# Altium schematic sheet CAN-Transceiver.SchDoc: CAN Transceiver 3V3
size A3; DrawnBy: Jonn Dillon; DocumentNumber: N/A; Revision: 02; SheetNumber: 1; SheetTotal: 1; Version: 01; Project: QUTMS Common Altium Schematics; PageSetup: Record=PageOptions|CenterHorizontal=True|CenterVertical=True|PrintScale=0.97|XCorrection=1.00|YCorrection=1.00|PrintKind=0|BorderSize=5000000|LeftOffset=0|BottomOffset=0|Orientation=2|PaperLength=1000|PaperWidth=1000|Scale=100|PaperSource=7|PrintQuality=-4|MediaType=1|DitherType=10|PaperKind=A4|PrintScaleMode=1
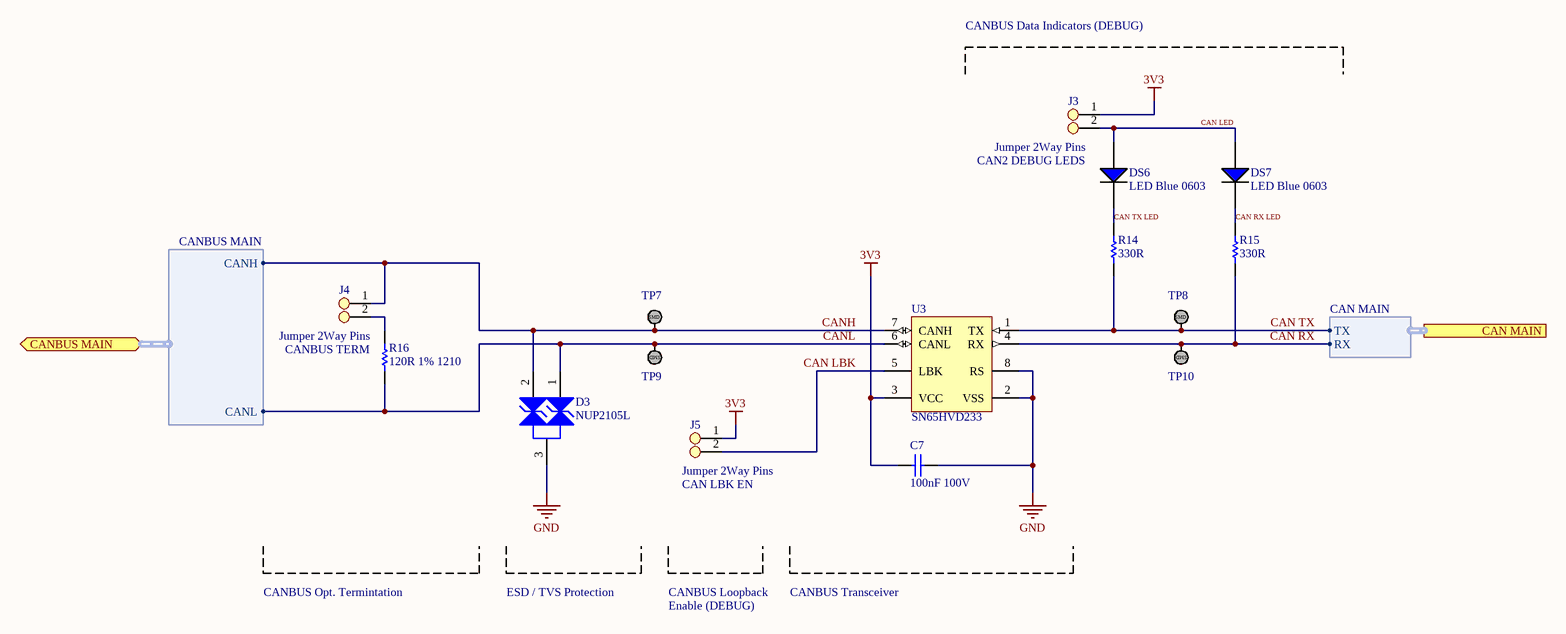
[diagram p0: CAN-Transceiver.SchDoc]

## Parts
C7  100nF 100V  [Cap_Ceramic_0603]
D3  NUP2105L  [NUP2105L]
DS6  LED Blue 0603  [LED BLUE 0603]
DS7  LED Blue 0603  [LED BLUE 0603]
J3  Jumper 2Way Pins  [Jumper_2Way_Pin]
J4  Jumper 2Way Pins  [Jumper_2Way_Pin]
J5  Jumper 2Way Pins  [Jumper_2Way_Pin]
R14  330R  [Res_ThinFilm_0603]
R15  330R  [Res_ThinFilm_0603]
R16  120R 1% 1210  [Res_ThinFilm_1210]
TP7  TestPoint_SMD  [TestPointSMD]  (value not drawn)
TP8  TestPoint_SMD  [TestPointSMD]  (value not drawn)
TP9  TestPoint_SMD  [TestPointSMD]  (value not drawn)
TP10  TestPoint_SMD  [TestPointSMD]  (value not drawn)
U3  SN65HVD233  [SN65HVD233DR]

## Ports
CAN MAIN (harness CAN MAIN), CANBUS MAIN (bidir, harness CANBUS MAIN)

## Harnesses
CANBUS MAIN: CANH, CANL
CAN MAIN: RX, TX

## Nets
3V3: C7.2 J3.1 J5.1 U3.3(VCC)
GND: C7.1 D3.3 U3.2(VSS) U3.8(RS)
CAN LBK: J5.2 U3.5(LBK)
CAN LED: DS6.1(A) DS7.1(A) J3.2
CAN RX: R15.1 TP10.1 U3.4(RX) ; port CAN MAIN.RX
CAN RX LED: DS7.2(C) R15.2
CAN TX: R14.1 TP8.1 U3.1(TX) ; port CAN MAIN.TX
CAN TX LED: DS6.2(C) R14.2
CANH: D3.2 J4.1 TP7.1 U3.7(CANH) ; port CANBUS MAIN.CANH
CANL: D3.1 R16.1 TP9.1 U3.6(CANL) ; port CANBUS MAIN.CANL
NetJ4_2: J4.2 R16.2

## Notes on the sheet
- CANBUS Data Indicators (DEBUG)
- CAN2 DEBUG LEDS
- (near R16) CANBUS TERM
- (near J5) CAN LBK EN
- CANBUS Opt. Termintation
- ESD / TVS Protection
- CANBUS Loopback
- Enable (DEBUG)
- CANBUS Transceiver
- Revision History:
- Sheet Title:
- Rev
- Date
- Description
- Project:
- Size:
- Drawn By:
- A3
- Number:
- Revision:
- Sheet
- Version:
- of
- QUT Motorsport
- O-120, Gardens Point
- 2 George Street
- Brisbane, QLD 4000
- Australia
- Print Date:
- Print Time:
- File Name:
- (in symbol TestPoint_SMD) SMD

## Library data of the parts
C7 = 100nF 100V 5% X7R 0603: Capacitor, Ceramic, SMD, 100nF, 100V, 5%, X7R, 0603
J3-J5 = Jumper 2Way Side Pins
R14 R15 = 330R 5% 0603: Resistor, SMD, 330R, 0.1W, 5%, 0603
R16 = 120R 1% 1210: Resistor, SMD, 120R, 0.25W, 1%, 1210
D3 = NUP2105L: ComponentLink1Description: Datasheet; ComponentLink1URL: https://www.onsemi.cn/PowerSolutions/document/NUP2105L-D.PDF; Parameter 1: *; ComponentLink2Description: LCSC; ComponentLink2URL: https://lcsc.com/product-detail/TVS_ON-Semiconductor-NUP2105LT1G_C14486.html; ComponentLink3Description: Digikey; ComponentLink3URL: https://www.digikey.com.au/product-detail/en/on-semiconductor/SZNUP2105LT1G/SZNUP2105LT1GOSCT-ND/3487669
U3 = SN65HVD233: ComponentLink1Description: LCSC; ComponentLink1URL: https://lcsc.com/product-detail/CAN-ICs_Texas-Instruments_SN65HVD233DRG4_Texas-Instruments-Texas-Instruments-SN65HVD233DRG4_C61643.html; ComponentLink2Description: Digikey; ComponentLink2URL: https://www.digikey.com.au/product-detail/en/texas-instruments/SN65HVD233DR/296-35967-1-ND/4134960; ComponentLink3Description: Datasheet; ComponentLink3URL: https://www.ti.com/lit/ds/symlink/sn65hvd233.pdf?ts=1588560888178; ComponentLink4Description: Ti Product Page; ComponentLink4URL: https://www.ti.com/product/SN65HVD233